# Altium schematic sheet Sheet1.SchDoc
size A4
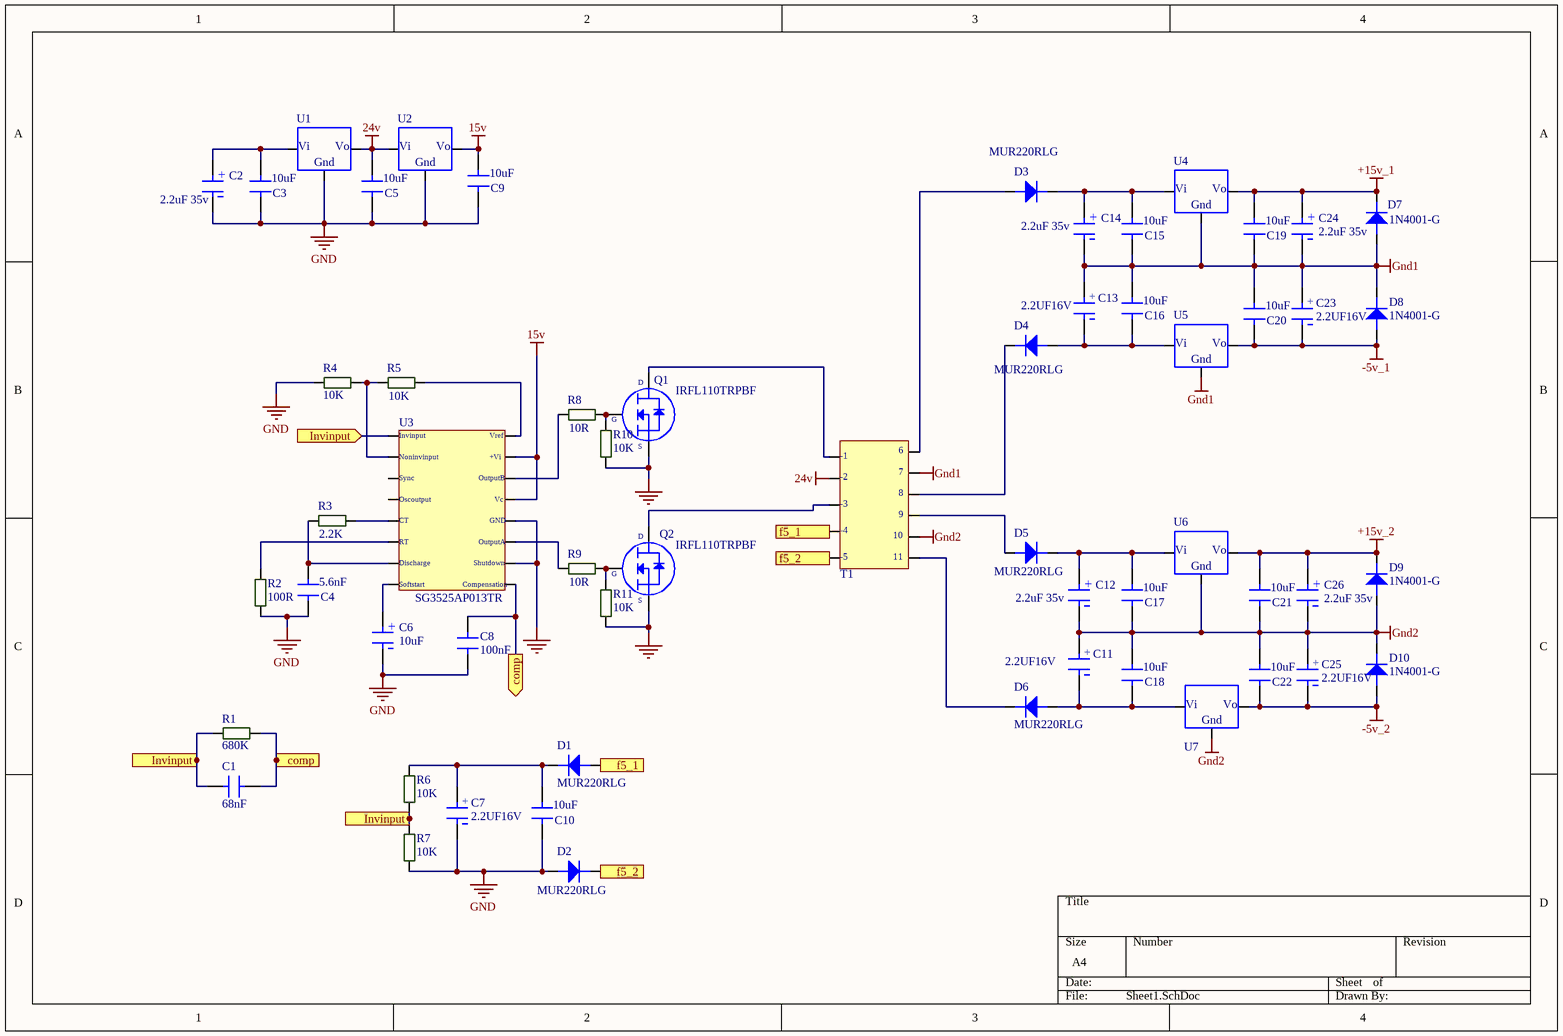
[diagram p0: Sheet1.SchDoc]

## Parts
C1  68nF
C2  2.2uF 35v
C3  10uF
C4  5.6nF
C5  10uF
C6  10uF
C7  2.2UF16V
C8  100nF
C9  10uF
C10  10uF
C11  2.2UF16V
C12  2.2uF 35v
C13  2.2UF16V
C14  2.2uF 35v
C15  10uF
C16  10uF
C17  10uF
C18  10uF
C19  10uF
C20  10uF
C21  10uF
C22  10uF
C23  2.2UF16V
C24  2.2uF 35v
C25  2.2UF16V
C26  2.2uF 35v
D1  MUR220RLG
D2  MUR220RLG
D3  MUR220RLG
D4  MUR220RLG
D5  MUR220RLG
D6  MUR220RLG
D7  1N4001-G
D8  1N4001-G
D9  1N4001-G
D10  1N4001-G
Q1  IRFL110TRPBF
Q2  IRFL110TRPBF
R1  680K
R2  100R
R3  2.2K
R4  10K
R5  10K
R6  10K
R7  10K
R8  10R
R9  10R
R10  10K
R11  10K
T1  EE2006Transformer  (value not drawn)
U1  L78M24CDT-TR  (value not drawn)
U2  L78M15CDT  (value not drawn)
U3  SG3525AP013TR
U4  L78M15CDT  (value not drawn)
U5  MC79M05CDTRKG  (value not drawn)
U6  L78M15CDT  (value not drawn)
U7  MC79M05CDTRKG  (value not drawn)

## Ports
comp (in), comp (out), f5_1 (in), f5_1 (out), f5_2 (in), f5_2 (out), Invinput (in), Invinput (out)

## Nets
15v: C9.3 U2.3 U3.13 U3.15
24v: C5.3 T1.2 U1.3 U2.1
+15v_1: C19.3 C24.1 D7.1 U4.3
+15v_2: C21.3 C26.1 D9.1 U6.3
-5v_1: C20.4 C23.2 D8.2 U5.2
-5v_2: C22.4 C25.2 D10.2 U7.2
GND: C2.2 C3.4 C4.4 C5.4 C6.2 C7.2 C8.3 C9.4 C10.4 D2.2 Q1.2 Q2.2 R2.2 R4.2 R7.2 R10.1 R11.2 U1.2 U2.2 U3.10 U3.12
Gnd1: C13.1 C14.2 C15.4 C16.3 C19.4 C20.3 C23.1 C24.2 D7.2 D8.1 T1.10 U4.2 U5.3
Gnd2: C11.1 C12.2 C17.4 C18.3 C21.4 C22.3 C25.1 C26.2 D9.2 D10.1 T1.7 U6.2 U7.3
comp: C1.4 C8.4 R1.1 U3.9 ; port comp
f5_1: D1.2 T1.4 ; port f5_1
f5_2: D2.1 T1.5 ; port f5_2
Invinput: C1.3 R1.2 R6.2 R7.1 U3.1 ; port Invinput
NetC2_1: C2.1 C3.3 U1.1
NetC4_3: C4.3 R3.2 U3.7
NetC6_1: C6.1 U3.8
NetC7_1: C7.1 C10.3 D1.1 R6.1
NetC11_2: C11.2 C18.4 D6.2 U7.1
NetC12_1: C12.1 C17.3 D5.1 U6.1
NetC13_2: C13.2 C16.4 D4.2 U5.1
NetC14_1: C14.1 C15.3 D3.1 U4.1
NetD3_2: D3.2 T1.11
NetD4_1: D4.1 T1.9
NetD5_2: D5.2 T1.8
NetD6_1: D6.1 T1.6
NetQ1_0: Q1.0 R8.1 R10.2
NetQ1_1: Q1.1 T1.1
NetQ2_0: Q2.0 R9.1 R11.1
NetQ2_1: Q2.1 T1.3
NetR2_1: R2.1 U3.6
NetR3_1: R3.1 U3.5
NetR4_1: R4.1 R5.2 U3.2
NetR5_1: R5.1 U3.16
NetR8_2: R8.2 U3.14
NetR9_2: R9.2 U3.11

Not connected (* = marked no-connect by the designer): U3 3 4

## Notes on the sheet
- (in symbol EE2006Transformer) -1; -2; -3; -4; -5
- (in symbol IRFL110TRPBF) Text; D; G; S
- (in symbol L78M15CDT) Vi; Vo; Gnd
- (in symbol L78M24CDT-TR) Vi; Vo; Gnd
- (in symbol MC79M05CDTRKG) Vi; Vo; Gnd
- (in symbol SG3525AP013TR) Invinput; Vref; Noninvinput; +Vi; Sync; OutputB; Oscoutput; Vc; CT; GND; RT; OutputA; Discharge; Shutdown; Softstart; Compensation
- (in symbol T491A225K016AT) +
- (in symbol T491A225K035AT) +

## Library data of the parts
C1 C3-C5 C8-C10 C15-C22 = CL31A106KBHNNNE: Cap Ceramic 10uF 50V X5R 10% SMD 1206 85C T/R; Manufacturer: Samsung; Supplier 1: Digi-Key; Manufacturer Part Number: CL31A106KBHNNNE; RoHS: Yes; Stock 1: 482000; Pricing 1: 2000 = 0,17875, 4000 = 0,16758 (USD); Mount: Surface Mount; Case/Package: 1206; Case Code (Metric): 3216; Case Code (Imperial): 1206; Material: Ceramic; Contact Plating: Tin; Min Operating Temperature: -55°C; Max Operating Temperature: 85°C; Capacitance: 10uF; Tolerance: 10%; Package Quantity: 1; Packaging: Tape and Reel; Voltage Rating: 50V; Dielectric: X5R; Voltage Rating (DC): 50V; Length: 3.2mm; Height: 1.6mm; Width: 0.063inch; Thickness: 0.071inch; Depth: 1.6mm; Radiation Hardening: No; Lead Free: Lead Free; ComponentLink1URL: https://media.digikey.com/pdf/Data%20Sheets/Samsung%20PDFs/CL_Series_MLCC_ds.pdf?src-supplier=Digi-Key; ComponentLink1Description: https://media.digikey.com/pdf/Data%20Sheets/Samsung%20PDFs/CL_Series_MLCC_ds.pdf?src-supplier=Digi-Key; ComponentLink2URL: http://www1.futureelectronics.com/doc/SAMSUNG%20PASSIVE/CL05B104KQ5NNNC.pdf?src-supplier=Future+Electronics; ComponentLink2Description: http://www1.futureelectronics.com/doc/SAMSUNG%20PASSIVE/CL05B104KQ5NNNC.pdf?src-supplier=Future+Electronics; ComponentLink3URL: http://www.rapidonline.com/pdf/71-0881.pdf?src-supplier=Rapid+Electronics; ComponentLink3Description: http://www.rapidonline.com/pdf/71-0881.pdf?src-supplier=Rapid+Electronics; ComponentLink4URL: https://www.verical.com/server-webapp/html/getDatasheet?partID=353196&src-supplier=Verical; ComponentLink4Description: https://www.verical.com/server-webapp/html/getDatasheet?partID=353196&src-supplier=Verical; ComponentLink5URL: https://produktinfo.conrad.com/datenblaetter/450000-474999/452492-da-01-en-VS_KONDENSATOR_1206.pdf?src-supplier=Conrad; ComponentLink5Description: https://produktinfo.conrad.com/datenblaetter/450000-474999/452492-da-01-en-VS_KONDENSATOR_1206.pdf?src-supplier=Conrad; Supplier Part Number 1: 1276-2876-2-ND
C2 C6 C12 C14 C24 C26 = T491A225K035AT: CAP TANT 2.2UF 35V 10% 1206; Manufacturer: KEMET; ESR (Equivalent Series Resistance): 4.5R; Polarity: Polar; Life (Hours): 2000Hour; Dissipation Factor: 6%; Supplier 1: Digi-Key; Manufacturer Part Number: T491A225K035AT; RoHS: Yes; Stock 1: 1476; Pricing 1: 1 = 0,62000, 10 = 0,44100, 100 = 0,29030, 500 = 0,21506, 1000 = 0,18280 (USD); Mount: Surface Mount; Case/Package: Molded; Case Code (Metric): 3216; Case Code (Imperial): 1206; Min Operating Temperature: -55°C; Max Operating Temperature: 125°C; Capacitance: 2.2uF; Tolerance: 10%; Package Quantity: 2000; Packaging: Tape and Reel; Voltage Rating: 35V; Voltage Rating (DC): 35V; Features: General Purpose; Length: 3.2mm; Height: 1.6mm; Width: 0.063inch; Height - Seated (Max): 0.071inch; Depth: 1.6mm; Radiation Hardening: No; REACH SVHC: No SVHC; Lead Free: Lead Free; ComponentLink1URL: http://www.kemet.com/Lists/ProductCatalog/Attachments/254/KEM_T2005_T491.pdf?src-supplier=Digi-Key; ComponentLink1Description: http://www.kemet.com/Lists/ProductCatalog/Attachments/254/KEM_T2005_T491.pdf?src-supplier=Digi-Key; Supplier Part Number 1: 399-10447-6-ND
C7 C11 C13 C23 C25 = T491A225K016AT: CAP TANT 2.2UF 10% 16V 1206; Manufacturer: KEMET; Dielectric Material: Tantalum; ESR (Equivalent Series Resistance): 6R; Leakage Current: 500nA; Polarity: Polar; Dissipation Factor: 6%; Life (Hours): 2000Hour; Supplier 1: Digi-Key; Manufacturer Part Number: T491A225K016AT; RoHS: Yes; Stock 1: 84000; Pricing 1: 2000 = 0,09450, 4000 = 0,08925, 10000 = 0,08400, 14000 = 0,08138, 50000 = 0,07350, 100000 = 0,07140 (USD); Mount: PCB,Surface Mount; Case/Package: 1206; Number of Pins: 2; Case Code (Metric): 3216; Case Code (Imperial): 1206; Min Operating Temperature: -55°C; Max Operating Temperature: 125°C; Capacitance: 2.2uF; Tolerance: 10%; Voltage Rating: 16V; Packaging: Tape and Reel; Package Quantity: 1; Voltage Rating (DC): 16V; Termination: SMD/SMT; Voltage: 16V; Features: General Purpose; Length: 3.2mm; Height: 1.6mm; Width: 1.6mm; Height - Seated (Max): 0.071inch; Depth: 1.6mm; Radiation Hardening: No; REACH SVHC: No SVHC; Lead Free: Lead Free; ComponentLink1URL: http://www.farnell.com/datasheets/1854511.pdf?src-supplier=Element14; ComponentLink1Description: http://www.farnell.com/datasheets/1854511.pdf?src-supplier=Element14; ComponentLink2URL: http://www.jameco.com/Jameco/Products/ProdDS/1573329.pdf?src-supplier=Jameco; ComponentLink2Description: http://www.jameco.com/Jameco/Products/ProdDS/1573329.pdf?src-supplier=Jameco; ComponentLink3URL: https://api.kemet.com/component-edge/download/datasheet/T491A225K016AT.pdf?src-supplier=Digi-Key; ComponentLink3Description: https://api.kemet.com/component-edge/download/datasheet/T491A225K016AT.pdf?src-supplier=Digi-Key; ComponentLink4URL: http://www.farnell.com/datasheets/1854511.pdf?src-supplier=Farnell; ComponentLink4Description: http://www.farnell.com/datasheets/1854511.pdf?src-supplier=Farnell; ComponentLink5URL: http://uk.rs-online.com/webdocs/1515/0900766b81515567.pdf?src-supplier=RSComponents; ComponentLink5Description: http://uk.rs-online.com/webdocs/1515/0900766b81515567.pdf?src-supplier=RSComponents; ComponentLink6URL: https://www.verical.com/server-webapp/html/getDatasheet?partID=120946&src-supplier=Verical; ComponentLink6Description: https://www.verical.com/server-webapp/html/getDatasheet?partID=120946&src-supplier=Verical; ComponentLink7URL: https://search.kemet.com/component-edge/download/datasheet/T491A225K016AT.pdf?src-supplier=Digi-Key; ComponentLink7Description: https://search.kemet.com/component-edge/download/datasheet/T491A225K016AT.pdf?src-supplier=Digi-Key; ComponentLink8URL: http://www.farnell.com/datasheets/1446014.pdf?src-supplier=Element14; ComponentLink8Description: http://www.farnell.com/datasheets/1446014.pdf?src-supplier=Element14; ComponentLink9URL: http://www.mouser.com/ds/2/212/KEM_T2005_T491-1093550.pdf?src-supplier=Mouser; ComponentLink9Description: http://www.mouser.com/ds/2/212/KEM_T2005_T491-1093550.pdf?src-supplier=Mouser; Supplier Part Number 1: 399-3691-2-ND
D1-D6 = MUR220RLG: DIODE GEN PURP 200V 2A AXIAL; Manufacturer: ON Semiconductor; Peak Reverse Current: 2uA; Max Surge Current: 35A; Recovery Time: 35ns; Forward Voltage: 950mV; Element Configuration: Single; Polarity: Standard; Supplier 1: Digi-Key; Manufacturer Part Number: MUR220RLG; RoHS: Yes; Stock 1: 4950; Pricing 1: 1 = 0,37000, 10 = 0,30200, 100 = 0,20590, 500 = 0,15446, 1000 = 0,11584 (USD); Case/Package: Axial; Number of Pins: 2; Contact Plating: Matte,Tin; Min Operating Temperature: -65°C; Max Operating Temperature: 175°C; Package Quantity: 5000; Packaging: Tape and Reel; Average Rectified Current: 2A; Reverse Recovery Time: 35ns; Max Repetitive Reverse Voltage (Vrrm): 200V; Peak Non-Repetitive Surge Current: 35A; Forward Current: 2A; Max Forward Surge Current (Ifsm): 35A; Voltage Rating (DC): 200V; Current Rating: 2A; Output Current: 2A; Max Reverse Voltage (DC): 200V; Reverse Voltage: 200V; Radiation Hardening: No; REACH SVHC: No SVHC; Lead Free: Lead Free; Halogen Free: Halogen Free; ComponentLink1URL: http://www.onsemi.com/pub/Collateral/MUR220-D.PDF?src-supplier=Avnet; ComponentLink1Description: http://www.onsemi.com/pub/Collateral/MUR220-D.PDF?src-supplier=Avnet; ComponentLink2URL: http://www.onsemi.com/pub/Collateral/MUR220-D.PDF?src-supplier=Digi-Key; ComponentLink2Description: http://www.onsemi.com/pub/Collateral/MUR220-D.PDF?src-supplier=Digi-Key; ComponentLink3URL: http://www.onsemi.com/pub/Collateral/MUR220-D.PDF?src-supplier=Avnet+Europe; ComponentLink3Description: http://www.onsemi.com/pub/Collateral/MUR220-D.PDF?src-supplier=Avnet+Europe; Supplier Part Number 1: MUR220RLGOSCT-ND
D7-D10 = 1N4001-G: DIODE GEN PURP 50V 1A DO41; Manufacturer: Comchip; Supplier 1: Digi-Key; Manufacturer Part Number: 1N4001-G; RoHS: Yes; Stock 1: 80000; Pricing 1: 5000 = 0,01691, 10000 = 0,01470, 25000 = 0,01323, 50000 = 0,01176, 125000 = 0,00978 (USD); Mount: Through Hole; Package Quantity: 5000; Packaging: Tape and Reel; Average Rectified Current: 1A; Max Reverse Voltage (DC): 50V; ComponentLink1URL: http://www.comchiptech.com/admin/files/product/1N4001-G%20Thru.%201N4007-G%20RevB.pdf?src-supplier=Digi-Key; ComponentLink1Description: http://www.comchiptech.com/admin/files/product/1N4001-G%20Thru.%201N4007-G%20RevB.pdf?src-supplier=Digi-Key; Supplier Part Number 1: 641-1310-3-ND
Q1 Q2 = IRFL110TRPBF: Trans MOSFET N-CH 100V 1.5A 4-Pin(3+Tab) SOT-223 T/R; Manufacturer: Vishay; Input Capacitance: 180pF; Number of Elements: 1; Max Power Dissipation: 2W; Rds On Max: 540mR; Rise Time: 16ns; Gate to Source Voltage (Vgs): 20V; Fall Time: 9.4ns; Turn-Off Delay Time: 15ns; Turn-On Delay Time: 6.9ns; Element Configuration: Single; Current: 15A; Supplier 1: Digi-Key; Manufacturer Part Number: IRFL110TRPBF; RoHS: Yes; Stock 1: 5000; Pricing 1: 2500 = 0,29779 (USD); Mount: Surface Mount; Case/Package: SOT-223; Number of Pins: 3; Weight: 0.008826oz; Contact Plating: Matte,Tin; Min Operating Temperature: -55°C; Max Operating Temperature: 150°C; Package Quantity: 1; Packaging: Tape and Reel; Drain to Source Voltage (Vdss): 100V; Continuous Drain Current (ID): 1.5A; Drain to Source Breakdown Voltage: 100V; Drain to Source Resistance: 540mR; Power Dissipation: 2W; Number of Channels: 1; Voltage: 100V; On-State Resistance: 540mR; Length: 6.7mm; Height: 1.8mm; Width: 3.7mm; Radiation Hardening: No; REACH SVHC: Unknown; Lead Free: Lead Free; ComponentLink1URL: http://www.vishay.com/docs/91192/sihfl110.pdf?src-supplier=Avnet; ComponentLink1Description: http://www.vishay.com/docs/91192/sihfl110.pdf?src-supplier=Avnet; ComponentLink2URL: http://www.vishay.com/docs/91192/sihfl110.pdf?src-supplier=Future+Electronics; ComponentLink2Description: http://www.vishay.com/docs/91192/sihfl110.pdf?src-supplier=Future+Electronics; ComponentLink3URL: http://www.vishay.com/docs/91192/sihfl110.pdf?src-supplier=Avnet+Europe; ComponentLink3Description: http://www.vishay.com/docs/91192/sihfl110.pdf?src-supplier=Avnet+Europe; ComponentLink4URL: https://www.verical.com/server-webapp/html/getDatasheet?partID=80948&src-supplier=Verical; ComponentLink4Description: https://www.verical.com/server-webapp/html/getDatasheet?partID=80948&src-supplier=Verical; ComponentLink5URL: http://www.vishay.com/docs/91192/sihfl110.pdf?src-supplier=Digi-Key; ComponentLink5Description: http://www.vishay.com/docs/91192/sihfl110.pdf?src-supplier=Digi-Key; ComponentLink6URL: http://uk.rs-online.com/webdocs/126c/0900766b8126cec6.pdf?src-supplier=RSComponents; ComponentLink6Description: http://uk.rs-online.com/webdocs/126c/0900766b8126cec6.pdf?src-supplier=RSComponents; ComponentLink7URL: http://www.jameco.com/Jameco/Products/ProdDS/1562152.pdf?src-supplier=Jameco; ComponentLink7Description: http://www.jameco.com/Jameco/Products/ProdDS/1562152.pdf?src-supplier=Jameco; ComponentLink8URL: http://datasheet.iiic.cc/vishay_[siliconix]/IRFL110TRPBF.pdf?src-supplier=IIIC; ComponentLink8Description: http://datasheet.iiic.cc/vishay_[siliconix]/IRFL110TRPBF.pdf?src-supplier=IIIC; Supplier Part Number 1: IRFL110PBFTR-ND
R1-R11 = RMCF1206ZT0R00: RES 0 OHM JUMPER 1/4W 1206; Manufacturer: Stackpole Electronics; Resistance: 0mR; Power Rating: 250mW; Current Rating: 2A; Working Voltage: 200V; Supplier 1: Digi-Key; Manufacturer Part Number: RMCF1206ZT0R00; RoHS: Yes; Stock 1: 1700000; Pricing 1: 5000 = 0,00355, 10000 = 0,00309, 25000 = 0,00271, 50000 = 0,00249, 125000 = 0,00244 (USD); Mount: Surface Mount; Case/Package: 1206; Case Code (Metric): 3216; Case Code (Imperial): 1206; Contact Plating: Matte,Tin; Min Operating Temperature: -55°C; Max Operating Temperature: 155°C; Packaging: Tape and Reel; Composition: Thick Film; Number of Terminations: 2; Military Standard: Not; Max Power Dissipation: 250mW; Features: Automotive AEC-Q200; Length: 0.126inch; Height: 0.028inch; Width: 0.063inch; Depth: 1.6mm; Radiation Hardening: No; Lead Free: Lead Free; Supplier Part Number 1: RMCF1206ZT0R00TR-ND
U1 = L78M24CDT-TR: IC REG LINEAR 24V 500MA DPAK; Manufacturer: STMicroelectronics; Number of Outputs: 1; Max Input Voltage: 40V; Min Input Voltage: 26V; Dropout Voltage: 2V; Polarity: Positive; Quiescent Current: 6mA; Power Supply Rejection Ratio (PSRR): 50dB; Output Type: Fixed; Supplier 1: Arrow; Manufacturer Part Number: L78M24CDT-TR; RoHS: Yes; Stock 1: 1; Pricing 1: 1 = 0,49540 (USD); Mount: Surface Mount; Case/Package: TO-252; Number of Pins: 3; Weight: 0.063493oz; Min Operating Temperature: 0°C; Max Operating Temperature: 150°C; Packaging: Tape and Reel; Output Voltage: 24V; Output Current: 500mA; Max Output Current: 500mA; Package Quantity: 1; Number of Regulators: 1; Nominal Output Voltage: 24V; Radiation Hardening: No; REACH SVHC: No SVHC; Lead Free: Lead Free; ComponentLink1URL: http://www.st.com/content/ccc/resource/technical/document/datasheet/d7/5f/dc/5c/d5/b6/48/7c/CD00000447.pdf/files/CD00000447.pdf/jcr:content/translations/en.CD00000447.pdf?src-supplier=Digi-Key; ComponentLink1Description: http://www.st.com/content/ccc/resource/technical/document/datasheet/d7/5f/dc/5c/d5/b6/48/7c/CD00000447.pdf/files/CD00000447.pdf/jcr:content/translations/en.CD00000447.pdf?src-supplier=Digi-Key; ComponentLink2URL: http://www.st.com/web/en/resource/technical/document/datasheet/CD00000447.pdf?src-supplier=Avnet; ComponentLink2Description: http://www.st.com/web/en/resource/technical/document/datasheet/CD00000447.pdf?src-supplier=Avnet; ComponentLink3URL: http://www.st.com/web/en/resource/technical/document/datasheet/CD00000447.pdf?src-supplier=Avnet+Europe; ComponentLink3Description: http://www.st.com/web/en/resource/technical/document/datasheet/CD00000447.pdf?src-supplier=Avnet+Europe; ComponentLink4URL: http://datasheet.iiic.cc/stmicroelectronics/L78M24CDT-TR.pdf?src-supplier=IIIC; ComponentLink4Description: http://datasheet.iiic.cc/stmicroelectronics/L78M24CDT-TR.pdf?src-supplier=IIIC; Supplier Part Number 1: L78M24CDT-TR
U2 U4 U6 = L78M15CDT: Linear Voltage Regulators 15V 0.5A Positive; Manufacturer: STMicroelectronics; Max Output Current: 500mA; Number of Outputs: 1; Max Input Voltage: 35V; Quiescent Current: 6mA; Output Type: Fixed; Dropout Voltage: 2V; Supplier 1: Avnet; Manufacturer Part Number: L78M15CDT; RoHS: Yes; Mount: Surface Mount; Case/Package: DPAK; Number of Pins: 3; Min Operating Temperature: 0°C; Max Operating Temperature: 150°C; Output Voltage: 15V; Polarity: Positive; Packaging: Rail/Tube; Output Current: 500mA; Min Input Voltage: 35V; Package Quantity: 75; Length: 6.6mm; Height: 2.4mm; Width: 6.2mm; Radiation Hardening: No; ComponentLink1URL: http://docs-usa.electrocomponents.com/techlib:/itc_doclist_US.htm?stockno=1890999&src-supplier=Allied+Electronics; ComponentLink1Description: http://docs-usa.electrocomponents.com/techlib:/itc_doclist_US.htm?stockno=1890999&src-supplier=Allied+Electronics; ComponentLink2URL: http://www.st.com/web/en/resource/technical/document/datasheet/CD00000447.pdf?src-supplier=Avnet+Europe; ComponentLink2Description: http://www.st.com/web/en/resource/technical/document/datasheet/CD00000447.pdf?src-supplier=Avnet+Europe; ComponentLink3URL: http://www.mouser.com/ds/2/389/stmicroelectronics_cd00000447-329548.pdf?src-supplier=Mouser; ComponentLink3Description: http://www.mouser.com/ds/2/389/stmicroelectronics_cd00000447-329548.pdf?src-supplier=Mouser; Supplier Part Number 1: L78M15CDT
U3 = SG3525AP013TR: IC REG CTRLR BCK/PSH-PULL 16SOIC; Manufacturer: STMicroelectronics; Max Supply Voltage: 35V; Output Current: 400A; Rise Time: 100ns; Number of Outputs: 2; Switching Frequency: 400kHz; Output Voltage: 5.2V; Max Frequency: 500kHz; Duty Cycle: 49%; Fall Time: 50ns; Operating Supply Current: 14mA; Max Supply Current: 20mA; Supplier 1: Digi-Key; RoHS: Yes; Stock 1: 5712; Pricing 1: 1 = 1,58000, 10 = 1,41600, 100 = 1,10400, 500 = 0,91196, 1000 = 0,71997 (USD); Mount: Surface Mount; Number of Pins: 16; Weight: 0.007079oz; Min Operating Temperature: 0°C; Max Operating Temperature: 70°C; Packaging: Tape and Reel; Package Quantity: 1; Max Duty Cycle: 49%; Radiation Hardening: No; Lead Free: Lead Free; ComponentLink1URL: http://www.st.com/content/ccc/resource/technical/document/datasheet/c0/12/98/4a/3b/1a/4b/8b/CD00000958.pdf/files/CD00000958.pdf/jcr:content/translations/en.CD00000958.pdf?src-supplier=Digi-Key; ComponentLink1Description: http://www.st.com/content/ccc/resource/technical/document/datasheet/c0/12/98/4a/3b/1a/4b/8b/CD00000958.pdf/files/CD00000958.pdf/jcr:content/translations/en.CD00000958.pdf?src-supplier=Digi-Key; ComponentLink2URL: https://www.verical.com/server-webapp/html/getDatasheet?partID=376579&src-supplier=Verical; ComponentLink2Description: https://www.verical.com/server-webapp/html/getDatasheet?partID=376579&src-supplier=Verical; ComponentLink3URL: http://www.produktinfo.conrad.com/datenblaetter/1100000-1199999/001185611-da-01-en-IC_REG_CTRLR_P_SG3525AP013TR_SOIC_16_STM.pdf?src-supplier=Conrad; ComponentLink3Description: http://www.produktinfo.conrad.com/datenblaetter/1100000-1199999/001185611-da-01-en-IC_REG_CTRLR_P_SG3525AP013TR_SOIC_16_STM.pdf?src-supplier=Conrad; Case/Package: SOIC; Supplier Part Number 1: 497-6479-1-ND; Manufacturer Part Number: SG3525AP013TR
U5 U7 = MC79M05CDTRKG: ON SEMICONDUCTOR - MC79M05CDTRKG - NEGATIVE VOLTAGE REGULATOR, -5V, DPAK-3; Max Input Voltage: -35V; Min Input Voltage: -7V; Max Output Current: 500mA; Number of Outputs: 1; Dropout Voltage: 1.1V; Accuracy: 4%; Max Output Voltage: -5.2V; Power Supply Rejection Ratio (PSRR): 66dB; Output Type: Fixed; Supplier 1: Digi-Key; Manufacturer: ON Semiconductor; Manufacturer Part Number: MC79M05CDTRKG; RoHS: Yes; Stock 1: 5000; Pricing 1: 2500 = 0,18538, 5000 = 0,17342, 12500 = 0,16146, 25000 = 0,15309, 62500 = 0,14950 (USD); Mount: Surface Mount; Case/Package: DPAK; Number of Pins: 3; Contact Plating: Matte,Tin; Min Operating Temperature: 0°C; Max Operating Temperature: 125°C; Packaging: Tape and Reel; Output Voltage: -5V; Output Current: 500mA; Nominal Output Voltage: -5V; Package Quantity: 1; Number of Regulators: 1; Polarity: Negative; Min Output Voltage: -5V; Output Voltage Accuracy: 4%; Length: 6.73mm; Height: 2.38mm; Width: 6.22mm; Radiation Hardening: No; REACH SVHC: No SVHC; Lead Free: Lead Free; Halogen Free: Halogen Free; ComponentLink1URL: http://www.farnell.com/datasheets/2236912.pdf?src-supplier=Newark; ComponentLink1Description: http://www.farnell.com/datasheets/2236912.pdf?src-supplier=Newark; ComponentLink2URL: http://www.onsemi.com/pub/Collateral/MC79M00-D.PDF?src-supplier=Digi-Key; ComponentLink2Description: http://www.onsemi.com/pub/Collateral/MC79M00-D.PDF?src-supplier=Digi-Key; ComponentLink3URL: http://www.farnell.com/datasheets/1747960.pdf?src-supplier=Element14; ComponentLink3Description: http://www.farnell.com/datasheets/1747960.pdf?src-supplier=Element14; ComponentLink4URL: http://www.onsemi.com/pub/Collateral/MC79M00-D.PDF?src-supplier=Avnet+Europe; ComponentLink4Description: http://www.onsemi.com/pub/Collateral/MC79M00-D.PDF?src-supplier=Avnet+Europe; Supplier Part Number 1: MC79M05CDTRKGOSTR-ND